# EAGLE design SparkFun_ESP8266_Thing (EAGLE 9.3.0)
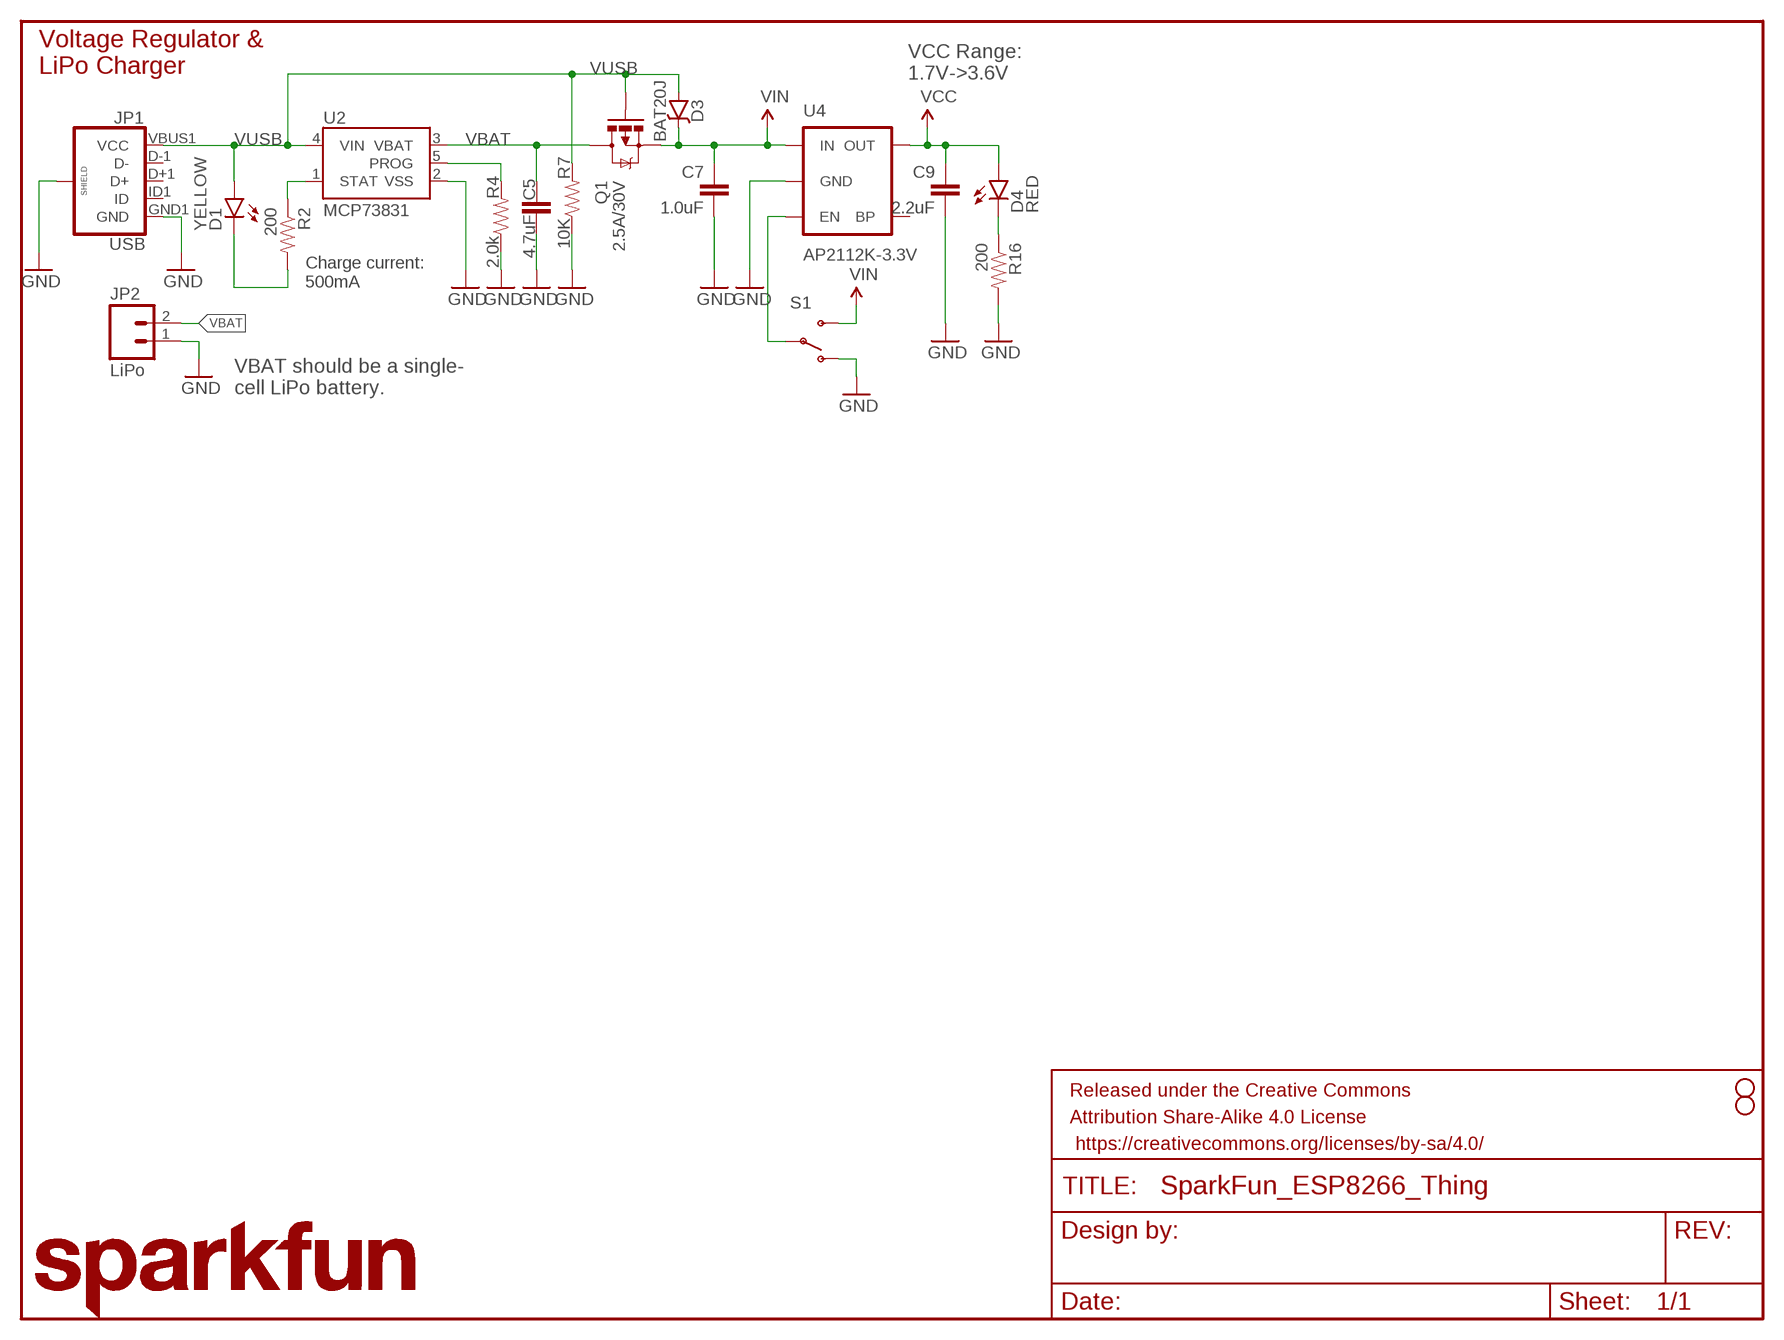
[diagram p0: schematic, sheet 1]

## Parts
C5  4.7uF  4.7UF-6.3V-10%(0603)0603  [0603-CAP]
C7  1.0uF  1.0UF-25V-+80/-20(0805)  [0805]
C9  2.2uF  2.2UF-10V-20%(0603)  [0603-CAP]
D1  YELLOW  LED-YELLOW0603  [LED-0603]
D3  BAT20J  DIODE-SCHOTTKY-BAT20J  [SOD-323]
D4  RED  LED-RED0603  [LED-0603]
FRAME1  FRAME-LETTER  [CREATIVE_COMMONS]
JP1  USB  USB_MICROB_PLUGCONN-11752  [USB-B-MICRO-SMD_V03]
JP2  LiPo  M02JST-PTH-2  [JST-2-PTH]
LOGO1  SFE_LOGO_NAME.2_INCH  [SFE_LOGO_NAME_.2]
Q1  2.5A/30V  MOSFET-PCHANNELDMG2307L  [SOT23-3]
R2  200  200OHM1/10W1%(0603)  [0603-RES]
R4  2.0k  2.0KOHM1/10W5%(0603)  [0603-RES]
R7  10K  10KOHM1/10W1%(0603)0603  [0603-RES]
R16  200  200OHM1/10W1%(0603)  [0603-RES]
S1  SWITCH-SPDT-SMD-A  [SWITCH-SPST-SMD-A]
STANDOFF3  STAND-OFF  [STAND-OFF]
STANDOFF4  STAND-OFF  [STAND-OFF]
U2  MCP73831  [SOT23-5]
U4  AP2112K-3.3V  V_REG_LDOSMD  [SOT23-5]

## Nets
GND: C5.2 C7.2 C9.2 JP1.GND1(GND) JP1.SHIELD1(SHIELD) JP1.SHIELD2(SHIELD) JP1.SHIELD3(SHIELD) JP2.1 R4.1 R7.1 R16.2 S1.1(O) U2.2(VSS) U4.2(GND)
N$4: D4.C R16.1
N$11: S1.2(P) U4.3(EN)
N$14: R4.2 U2.5(PROG)
N$17: D1.C R2.2
N$18: R2.1 U2.1(STAT)
VBAT: C5.1 JP2.2 Q1.3(D) U2.3(VBAT)
VCC: C9.1 D4.A U4.5(OUT)
VIN: C7.1 D3.C Q1.2(S) S1.3(S) U4.1(IN)
VUSB: D1.A D3.A JP1.VBUS1(VCC) Q1.1(G) R7.2 U2.4(VIN)
Unconnected: JP1.D+1(D+) JP1.D-1(D-) JP1.ID1(ID) U4.4(BP)

## Notes on the sheet
- Voltage Regulator &
  LiPo Charger
- VCC Range:
  1.7V->3.6V
- Charge current:
  500mA
- VBAT should be a single-
  cell LiPo battery.

## Library data of the parts
C5 = SparkFun-Capacitors:4.7UF-6.3V-10%(0603): CAP-08280; PROD_ID: CAP-08280
C7 = SparkFun-Capacitors:1.0UF-25V-+80/-20(0805): CAP-11625; PROD_ID: CAP-11625
C9 = SparkFun-Capacitors:2.2UF-10V-20%(0603): CAP-07888; PROD_ID: CAP-07888
D1 = SparkFun-LED:LED-YELLOW: Yellow SMD LEDs LilyPad 1206- DIO-09909 0603- DIO-09003; PROD_ID: DIO-09003
D3 = SparkFun-DiscreteSemi:DIODE-SCHOTTKY: Schottky diodes in SFE's production catalog BAT20J 1A 23V 0.62Vf RB751 120mA 40V 0.37Vf PMEG4005EJ 0.5A 40V 0.42Vf MBRA140 1A 40V 0.5Vf B340A 3A 40V SMA; PROD_ID: DIO-11623
D4 = SparkFun-LED:LED-RED: Assorted Red LEDs LilyPad 1206- DIO-09912 1206- DIO-00809 0603- DIO-00819; PROD_ID: DIO-00819
FRAME1 = SparkFun-Aesthetics:FRAME-LETTER: Schematic Frame Standard 8.5x11 US Letter frame
JP1 = SparkFun-Connectors:USB_MICROB_PLUG: USB Micro-B connectors Some male, some female. Watch your step!; PROD_ID: CONN-11752
JP2 = SparkFun-Connectors:M02: Standard 2-pin 0.1" header. Use with - straight break away headers ( PRT-00116) - right angle break away headers (PRT-00553) - swiss pins (PRT-00743) - machine pins (PRT-00117) - female headers (PRT-00115) Molex polarized connector foot print use with: PRT-08233 with associated crimp pins and housings. 2.54_SCREWTERM for use with PRT-10571. 3.5mm Screw Terminal footprints for PRT-08084 5mm Screw Terminal footprints for use with PRT-08432; SKU: PRT-09914
LOGO1 = SparkFun-Aesthetics:SFE_LOGO_NAME: SFE Logo, name only This is the SparkFun name logo. The logo on the schematic will always be the same size; the package variant is the height of the flame part of the logo (or the height the flame would be, if it were drawn). Default layer for the logo on the board is tSilk.
Q1 = SparkFun-DiscreteSemi:MOSFET-PCHANNEL: Generic PMOSFET IRLML2244 - TRANS-11153 (SOT-23 -20V -4.3A) (1.Gate 2.Source 3.Drain) FQP27P06 - COM-10349 <http://www.sparkfun.com/products/10349> (TO-220 -60V -27A) (1.Gate 2.Source 3.Drain); PROD_ID: TRANS-11308
R2 R16 = SparkFun-Resistors:200OHM1/10W1%(0603): RES-08220; PROD_ID: RES-08220
R4 = SparkFun-Resistors:2.0KOHM1/10W5%(0603): RES-08296; PROD_ID: RES-08296
R7 = SparkFun-Resistors:10KOHM1/10W1%(0603): RES-00824; PROD_ID: RES-00824
S1 = SparkFun-Electromechanical:SWITCH-SPDT: SPDT Switch Simple slide switch, Spark Fun Electronics SKU : COM-00102 DPDT SMT slide switch, AYZ0202, SWCH-08179; PROD_ID: SWCH-10651
STANDOFF3 STANDOFF4 = SparkFun-Electromechanical:STAND-OFF: #4 Stand Off This is the mechanical footprint for a #4 phillips button head screw. Use the keepout ring to avoid running the screw head into surrounding components. SKU : PRT-00447
U2 = SparkFun-PowerIC:MCP73831: Miniature single cell, fully integrated Li-Ion, Li-polymer charge management controller http://ww1.microchip.com/downloads/en/DeviceDoc/21984a.pdf IC-09995; PROD_ID: IC-09995
U4 = SparkFun-PowerIC:V_REG_LDO: Voltage Regulator LDO Standard 150mA LDO voltage regulator in SOT-23 layout. Micrel part MIC5205. BP (by-pass) pin is used to lower output noise with 470pF cap.; PROD_ID: VREG-12457

## Board
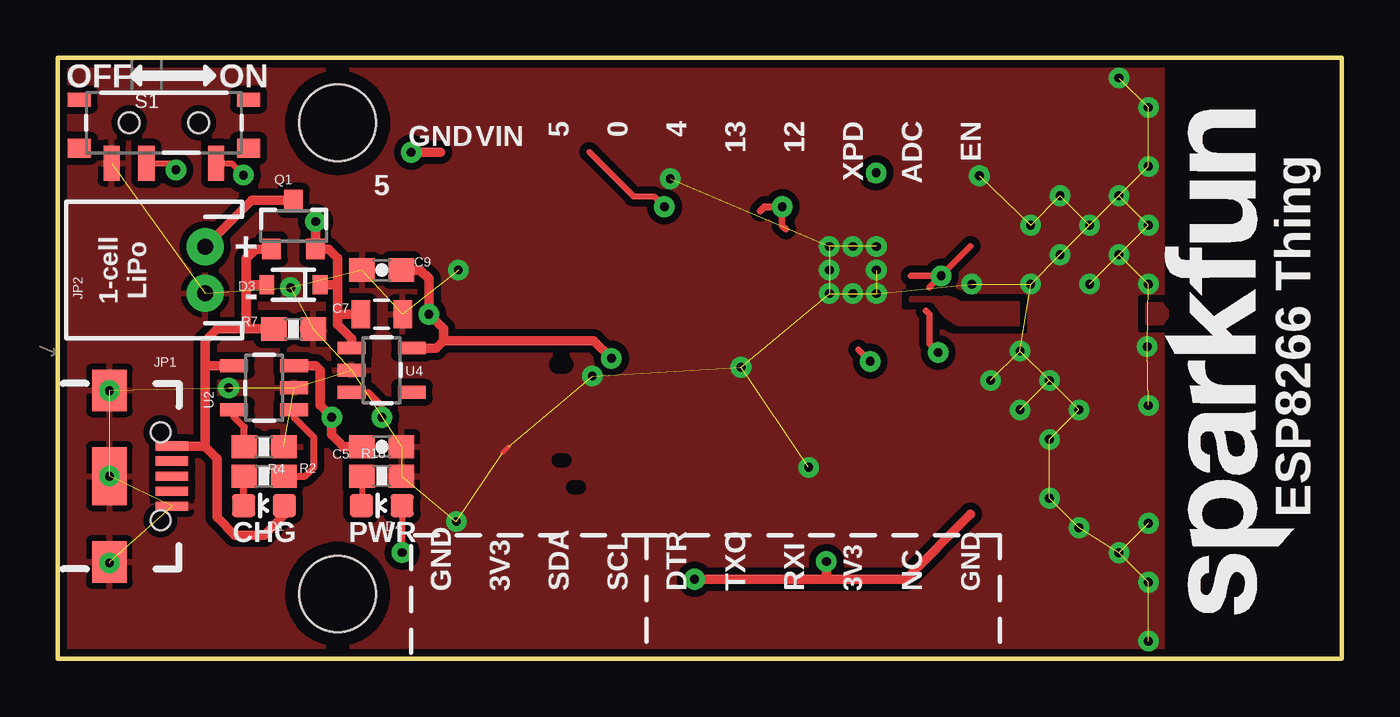
[diagram p1: board, top side]
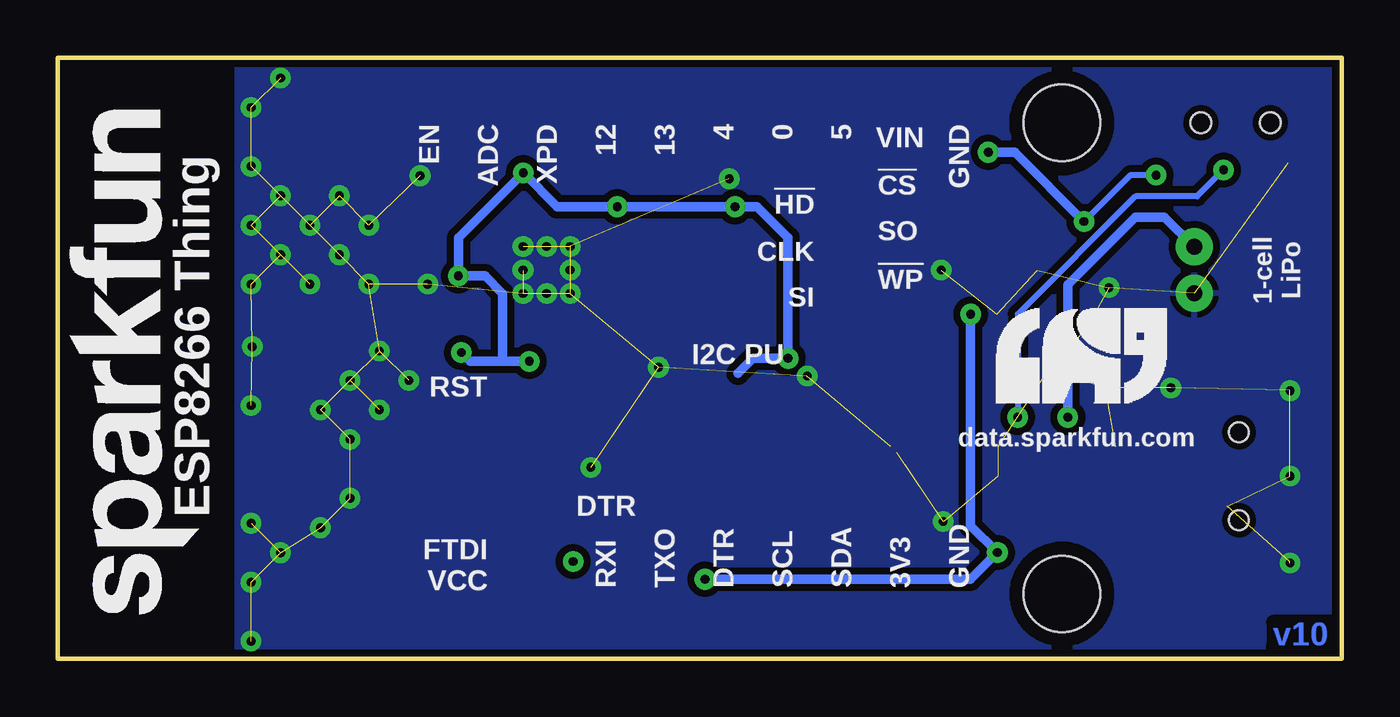
[diagram p2: board, bottom side, seen from below]

Size 55.37 x 25.91 mm. Coordinates in mm from the lower left corner, seen from the top.
Outline: 0,0 0,25.91 55.37,25.91 55.37,0 0,0
Copper layers (1*16): Top 0.035mm / dielectric 1.5mm / Bottom 0.035mm
Design rules "SparkFun-2-layer": minimum track width 7mil, minimum drill 15mil, track to track 8mil, track to pad 8mil, pad to pad 8mil, via to via 8mil, smd to smd 8mil, copper to edge 8mil, drill to drill 8mil, minimum pad ring 12mil, minimum via ring 10mil, stop-mask expansion 4mil, vias tented up to drill 20mil, thermal gap 10mil
tRestrict: 3 lines

### Footprints (pad centres in the part's own frame; a part is rotated, then mirrored left to right if it is on the bottom)
0603-CAP = smd 1.1 x 1: 1 -0.85,0; 2 0.85,0
0805 = smd 0.8 x 1.2: 1 -0.9,0; 2 0.9,0
LED-0603 = smd 1 x 1: A 0,-0.877; C 0,0.877
SOD-323 = smd 0.63 x 0.83: A 1.15,0; C -1.15,0
USB-B-MICRO-SMD_V03 = smd 1.4 x 0.4: D+1 2.7,0; D-1 2.7,0.65; GND1 2.7,-1.3; ID1 2.7,-0.65; VBUS1 2.7,1.3 | smd 1.5 x 1.8: SHIELD1 0,3.7; SHIELD2 0,-3.7 | smd 1.5 x 2.5: SHIELD3 0,0 | hole 0.85: 2.2,1.9; 2.2,-1.9
JST-2-PTH = drill 0.7 pad 1.6: 1 -1,0; 2 1,0
SOT23-3 = smd 0.8 x 0.9: 1 -0.95,-1; 2 0.95,-1; 3 0,1.1
0603-RES = smd 1.1 x 1: 1 -0.85,0; 2 0.85,0
SWITCH-SPST-SMD-A = smd 0.7 x 1.5: 1 -2.25,-1.75; 2 -0.75,-1.75; 3 2.25,-1.75 | smd 1 x 0.6: GND1 -3.65,1; GND3 3.65,1 | smd 1 x 0.8: GND2 -3.65,-1.1; GND4 3.65,-1.1 | hole 0.9: -1.5,0; 1.5,0
STAND-OFF = hole 3.302: 0,0
SOT23-5 = smd 0.55 x 1.2: 1 -0.95,-1.3; 2 0,-1.3; 3 0.95,-1.3; 4 0.95,1.3; 5 -0.95,1.3

### Placement (x,y rotation side)
C5  13.97,9.14 0 top
C7  13.97,14.86 0 top
C9  13.97,16.76 180 top
D1  8.89,6.6 90 top
D3  10.16,16.13 180 top
D4  13.97,6.6 90 top
FRAME1  -2.03,-18.29 0 top  (outside the outline)
JP1  2.22,7.87 0 top
JP2  6.35,16.76 90 top
LOGO1  49.28,1.91 90 bottom
LOGO5  SFE_LOGO_NAME.2_INCH  [SFE_LOGO_NAME_.2]  53.34,1.91 90 top
Q1  10.16,18.67 0 top
R2  8.89,7.87 180 top
R4  8.89,9.14 180 top
R7  10.16,14.22 180 top
R16  13.97,7.87 0 top
S1  4.57,23.11 0 top
STANDOFF3  12.06,23.11 0 top
STANDOFF4  12.06,2.79 0 top
U2  8.89,11.68 90 top
U4  13.97,12.45 270 top

### Tracks (layer width: path | path; a pad name or v marks a point on that pad's centre or on a via)
GND  (via drill 0.38)  (61 unrouted)
  Top 0.203: 19.43,9.15 19.18,8.89
  other vias: 34.29,17.78 34.29,15.75 33.27,16.76 33.27,17.78 33.27,15.75 35.31,17.78 35.31,16.76 35.31,15.75 39.75,20.83 26.42,20.7 7.37,11.68 2.22,11.56 2.22,7.87 2.22,4.13 17.27,16.76 46.99,13.46 47.04,10.92 47.04,5.84 47.04,3.3 47.04,0.76 47.04,16.15 47.04,18.69 47.04,21.23 47.04,23.77 45.77,25.04 45.77,19.96 45.77,17.42 45.77,4.57 43.23,19.96 41.96,18.69 41.96,16.15 44.5,16.15 44.5,18.69 43.23,17.42 39.42,16.15 40.23,12 41.5,13.27 42.77,12 44.04,10.73 41.5,10.73 42.77,9.46 42.77,6.92 44.04,5.65 29.46,12.57 32.38,8.25 10.03,16 23.05,12.19 17.18,5.92
  pour Top (isolate 0.305, rank 6): 0,25.91 0,0 47.62,0 47.62,25.91
  pour Bottom (isolate 0.305): 0,25.91 0,0 47.62,0 47.62,25.91
LNA
  pour Top (isolate 0.012, rank 2, no thermals): 36.8,15.55 38.22,15.57 arc-45 38.9,15.33 41.4,15.33 41.4,14.43 38.9,14.43 arc-44 37.98,15.18 arc-25 37.98,15.18 arc71 37.6,15.47 36.8,15.47
N$4
  Top 0.254: R16.1 13.12,6.63 D4.C
N$11  (via drill 0.38)
  Top 0.254: U4.3 13.4,11.5 13.97,10.93 v13.97,10.41 | S1.2 4.81,21.36 v5.09,21.08
  Bottom 0.254: v13.97,10.41 13.97,14.86 8.89,19.94 6.24,19.94 v5.09,21.08
N$14
  Top 0.305: R4.2 8.04,9.99 7.59,10.44 U2.5
N$17
  Top 0.305: D1.C 8.01,7.85 R2.2
N$18
  Top 0.305: R2.1 10.67,7.87 11.05,8.25 11.05,9.53 10.19,10.38 U2.1
TRACE_ANT
  pour Top (no thermals): 46.99,14.48 46.99,15.29 47.62,15.29 arc30 47.83,15.01 47.83,14.74 arc30 47.64,14.48
VBAT  (via drill 0.38)
  Top 0.406: C5.1 12.32,9.14 11.81,9.65 v11.81,10.41 11.3,10.92 11.3,12.45 11.12,12.63 U2.3 | Q1.3 8.36,19.77 JP2.2
  Bottom 0.406: v11.81,10.41 11.81,16.13 8.89,19.05 7.64,19.05 JP2.2
VCC  (via drill 0.38)
  Top 0.203: 24.13,12.7 v23.88,12.95
  Top 0.254: 22.92,21.84 24.83,19.94 25.72,19.94 v26.16,19.5 | D4.A v14.85,4.58
  Top 0.279: 34.54,13.33 v35.04,12.83 | 35.04,20.7 v35.29,20.96 | 37.44,15.01 37.59,14.86 37.59,13.59 v37.97,13.21 | v38.1,16.51 36.79,16.51 | 39.37,17.78 v38.1,16.51 | 37.6,16.01 v38.1,16.51 | 31.4,18.51 31.24,18.67 v31.24,19.5
  Top 0.305: 30.29,19.3 30.48,19.5 v31.24,19.5
  Top 0.406: 33.15,3.43 27.94,3.43 v27.46,3.43 | 33.15,3.43 36.58,3.43 39.37,6.22 | v33.15,4.19 33.15,3.43 | C9.1 15.62,16.76 16,16.38 v16,14.86 16.64,14.22 16.64,13.72 | U4.5 16.32,13.4 16.64,13.72 | v23.88,12.95 23.11,13.72 16.64,13.72
  Bottom 0.406: 36.2,12.83 37.59,12.83 v37.97,13.21 | 36.2,12.83 v35.04,12.83 | 36.2,12.83 36.2,15.75 36.96,16.51 v38.1,16.51 38.1,18.15 v35.29,20.96 33.83,19.5 v31.24,19.5 v26.16,19.5 25.21,19.5 23.88,18.16 v23.88,12.95 25.4,12.95 26.04,12.32 | 33.27,4.06 v33.15,4.19 | v27.46,3.43 19.05,3.43 16,3.43 v14.85,4.58 16,5.74 v16,14.86
VIN  (via drill 0.38)
  Top 0.254: S1.3 7.49,21.36 v8,20.86
  Top 0.406: 12.06,16.13 12.06,17.27 11.67,17.67 Q1.2 v11.11,18.85 v11.11,18.86 | D3.C 12.06,16.13 | v15.24,21.84 16.51,21.84 | 12.06,16.13 12.06,14.86 | 12.06,14.86 12.06,14.4 12.67,13.8 U4.1 | C7.1 12.06,14.86
  Bottom 0.254: v8,20.86 9.11,20.86 v11.11,18.86
  Bottom 0.406: v15.24,21.84 14.1,21.84 v11.11,18.86
VUSB
  Top 0.305: 6.35,9.17 6.35,9.14
  Top 0.406: JP1.VBUS1 6.35,9.17 6.35,12.63 | 6.35,9.14 6.86,8.64 6.86,6.1 7.62,5.33 8.89,5.33 9.77,6.21 D1.A | 6.35,12.63 6.35,13.72 6.86,14.22 8.13,14.22 | 8.13,14.22 8.13,16.13 | 8.13,16.13 8.13,17.27 8.53,17.67 Q1.1 | D3.A 8.13,16.13 | 8.13,14.22 R7.2 | U2.4 6.35,12.63

### Text on the board
Bottom: v10
tPlace: OFF | ON | GND | VIN | 5 | 0 | 4 | 13 | 12 | XPD | ADC | EN | 5 | + | 1-cell / LiPo | - | CHG | PWR | ESP8266 Thing | GND | 3V3 | SDA | SCL | DTR | TXO | RXI | 3V3 | NC | GND
bPlace: GND | VIN | 5 | 0 | 4 | 13 | 12 | XPD | ADC | EN | !CS! | !HD! | SO | 1-cell / LiPo | CLK | !WP! | SI | I2C PU | RST | data.sparkfun.com | DTR | ESP8266 Thing | FTDI / VCC | GND | 3V3 | SDA | SCL | DTR | TXO | RXI
tDocu: Jim Lindblom